# Altium schematic sheet 3_INTERFACE_PWR_LS_HS.schdoc
size 304 x 205 mm; Symbol: Altium_A4; Device: Altium_A4
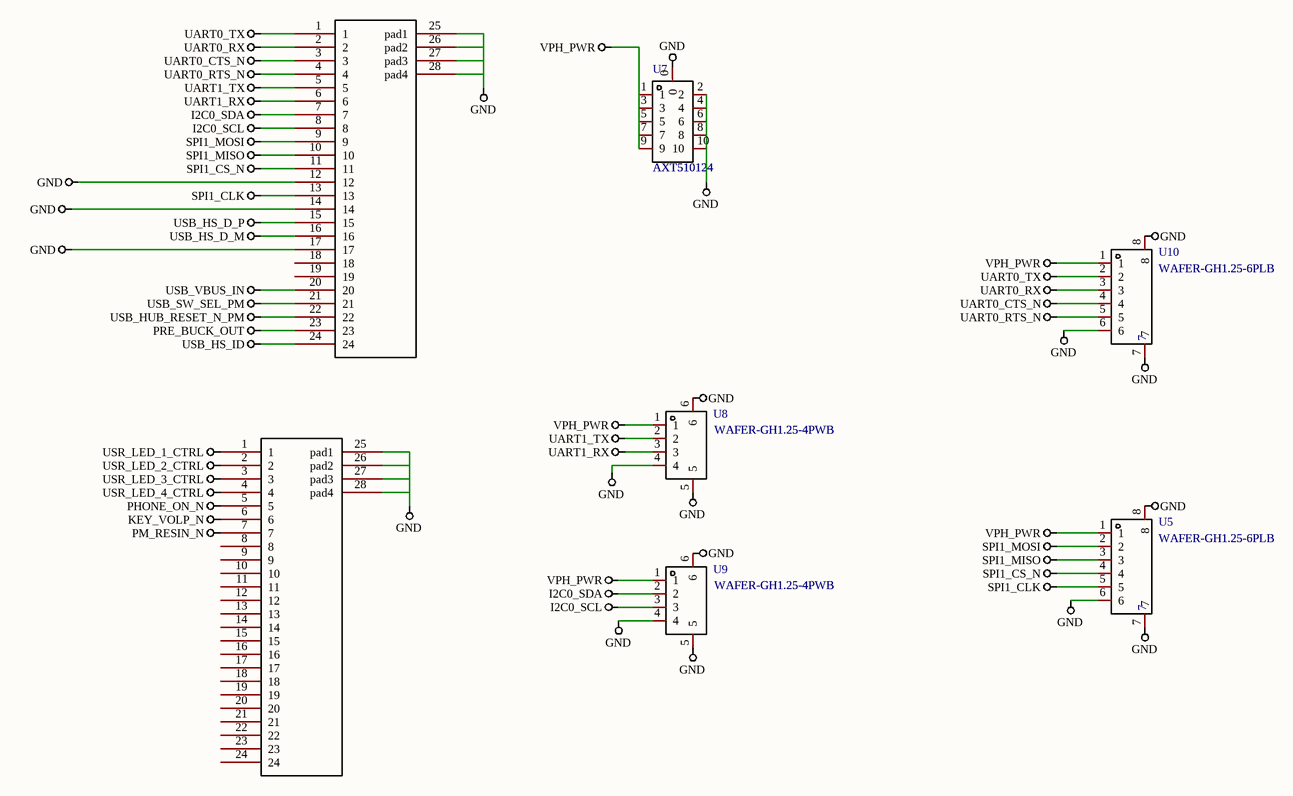
[diagram p0: 3_INTERFACE_PWR_LS_HS.schdoc]

## Parts
CN1  CON24_0  (value not drawn)
CN2  CON24_0  (value not drawn)
U5  WAFER-GH1.25-6PLB  NAME: 7  [CONN-SMD_6P-P1.25_XUNPU_WAFER-GH1.25-6PLB]
U7  AXT510124  [CONN-SMD_10P-P0.40_AXT510124]
U8  WAFER-GH1.25-4PWB  [CONN-SMD_4P-P1.25_XUNPU_WAFER-GH1.25-4PWB]
U9  WAFER-GH1.25-4PWB  [CONN-SMD_4P-P1.25_XUNPU_WAFER-GH1.25-4PWB]
U10  WAFER-GH1.25-6PLB  NAME: 7  [CONN-SMD_6P-P1.25_XUNPU_WAFER-GH1.25-6PLB]

## Nets
GND: CN1.12 CN1.14 CN1.17 CN1.25(pad1) CN1.26(pad2) CN1.27(pad3) CN1.28(pad4) CN2.25(pad1) CN2.26(pad2) CN2.27(pad3) CN2.28(pad4) U5.6 U5.7 U5.8 U7.0 U7.2 U7.4 U7.6 U7.8 U7.10 U8.4 U8.5 U8.6 U9.4 U9.5 U9.6 U10.6 U10.7 U10.8
I2C0_SCL: CN1.8 U9.3
I2C0_SDA: CN1.7 U9.2
KEY_VOLP_N: CN2.6
PHONE_ON_N: CN2.5
PM_RESIN_N: CN2.7
PRE_BUCK_OUT: CN1.23
SPI1_CLK: CN1.13 U5.5
SPI1_CS_N: CN1.11 U5.4
SPI1_MISO: CN1.10 U5.3
SPI1_MOSI: CN1.9 U5.2
UART0_CTS_N: CN1.3 U10.4
UART0_RTS_N: CN1.4 U10.5
UART0_RX: CN1.2 U10.3
UART0_TX: CN1.1 U10.2
UART1_RX: CN1.6 U8.3
UART1_TX: CN1.5 U8.2
USB_HS_D_M: CN1.16
USB_HS_D_P: CN1.15
USB_HS_ID: CN1.24
USB_HUB_RESET_N_PM: CN1.22
USB_SW_SEL_PM: CN1.21
USB_VBUS_IN: CN1.20
USR_LED_1_CTRL: CN2.1
USR_LED_2_CTRL: CN2.2
USR_LED_3_CTRL: CN2.3
USR_LED_4_CTRL: CN2.4
VPH_PWR: U5.1 U7.1 U7.3 U7.5 U7.7 U7.9 U8.1 U9.1 U10.1

Not connected (* = marked no-connect by the designer): CN1 18 19; CN2 8 9 10 11 12 13 14 15 16 17 18 19 20 21 22 23 24

## Notes on the sheet
- 1
- 2
- 3
- 4
- 5
- 6
- A
- B
- C
- Title
- D
- Size
- A4
- Number
- Revision
- File:
- Date:
- Drawn By:
- Sheet
- Of

## Library data of the parts
CN1 CN2 = CON24_0: Add into BOM: yes; Name: CON24_0; Symbol: CON24_0; Device: CON24_0; Convert to PCB: yes; Origin Footprint: CON24_0; Design Item ID: CON24_0; Library Name: MSM8916_DRAM_PMIC_REF_Library
U5 U10 = WAFER-GH1.25-6PLB: 参考系列:GH;间距:1.25mm;插针结构:1x6P;排数:1;每排PIN数:6;公母:公型插针;安装方式:立贴;额定电流:1A;工作温度范围:-25℃~+85℃;; Manufacturer: XUNPU(讯普); Add into BOM: yes; Reference Series: GH; Pitch: 1.25mm; Pins Structure: 1x6P; Number of PINs Per Row: 6; Gender: 公型插针; Current Rating (Max): 1A; Name: WAFER-GH1.25-6PLB; Symbol: WAFER-GH1.25-6PLB; Device: WAFER-GH1.25-6PLB; LCSC Part Name: GH1.25mm 6P 立贴带扣 带扣; Supplier Part: C3029372; Manufacturer Part: WAFER-GH1.25-6PLB; Supplier Footprint: SMD,P=1.25mm; JLCPCB Part Class: Extended Part; Datasheet: https://atta.szlcsc.com/upload/public/pdf/source/20220527/44F824AAC8C2B617205E15955FF9C23D.pdf; Supplier: LCSC; Convert to PCB: yes; Number of Rows: 1; Mounting Style: 立贴; Operating Temperature Range: -25℃~+85℃
U7 = AXT510124: PIN总数:10;间距:0.4mm;行数:2;公母:母;安装方式:立贴;; Manufacturer: PANASONIC(松下); Add into BOM: yes; Pitch: 0.4mm; Gender: 母; Name: AXT510124; Symbol: AXT510124; Device: AXT510124; LCSC Part Name: PIN：10 间距0.4mm 母 立贴; Supplier Part: C425120; Manufacturer Part: AXT510124; Supplier Footprint: SMD,P=0.4mm; JLCPCB Part Class: Extended Part; Datasheet: https://atta.szlcsc.com/upload/public/pdf/source/20220303/08A7FC8592C4EAD5E0FE06CDCFEE422B.pdf; Supplier: LCSC; Convert to PCB: yes; Number of Pins: 10; Number of Rows: 2; Mounting Style: 立贴
U8 U9 = WAFER-GH1.25-4PWB: 参考系列:GH;间距:1.25mm;插针结构:1x4P;排数:1;每排PIN数:4;公母:公型插针;安装方式:卧贴;额定电流:1A;工作温度范围:-25℃~+85℃;; Manufacturer: XUNPU(讯普); Add into BOM: yes; Reference Series: GH; Pitch: 1.25mm; Pins Structure: 1x4P; Number of PINs Per Row: 4; Gender: 公型插针; Current Rating (Max): 1A; Name: WAFER-GH1.25-4PWB; Symbol: WAFER-GH1.25-4PWB; Device: WAFER-GH1.25-4PWB; LCSC Part Name: GH 1.25mm 1x4P 卧贴 带扣; Supplier Part: C3029379; Manufacturer Part: WAFER-GH1.25-4PWB; Supplier Footprint: SMD,P=1.25mm; JLCPCB Part Class: Extended Part; Datasheet: https://atta.szlcsc.com/upload/public/pdf/source/20220527/CB8773BFB0913C3B8ABD62CB38BA101A.pdf; Supplier: LCSC; Convert to PCB: yes; Number of Rows: 1; Mounting Style: 卧贴; Operating Temperature Range: -25℃~+85℃